# EAGLE design Uzebox Game Console nano4 (EAGLE 7.6.0)
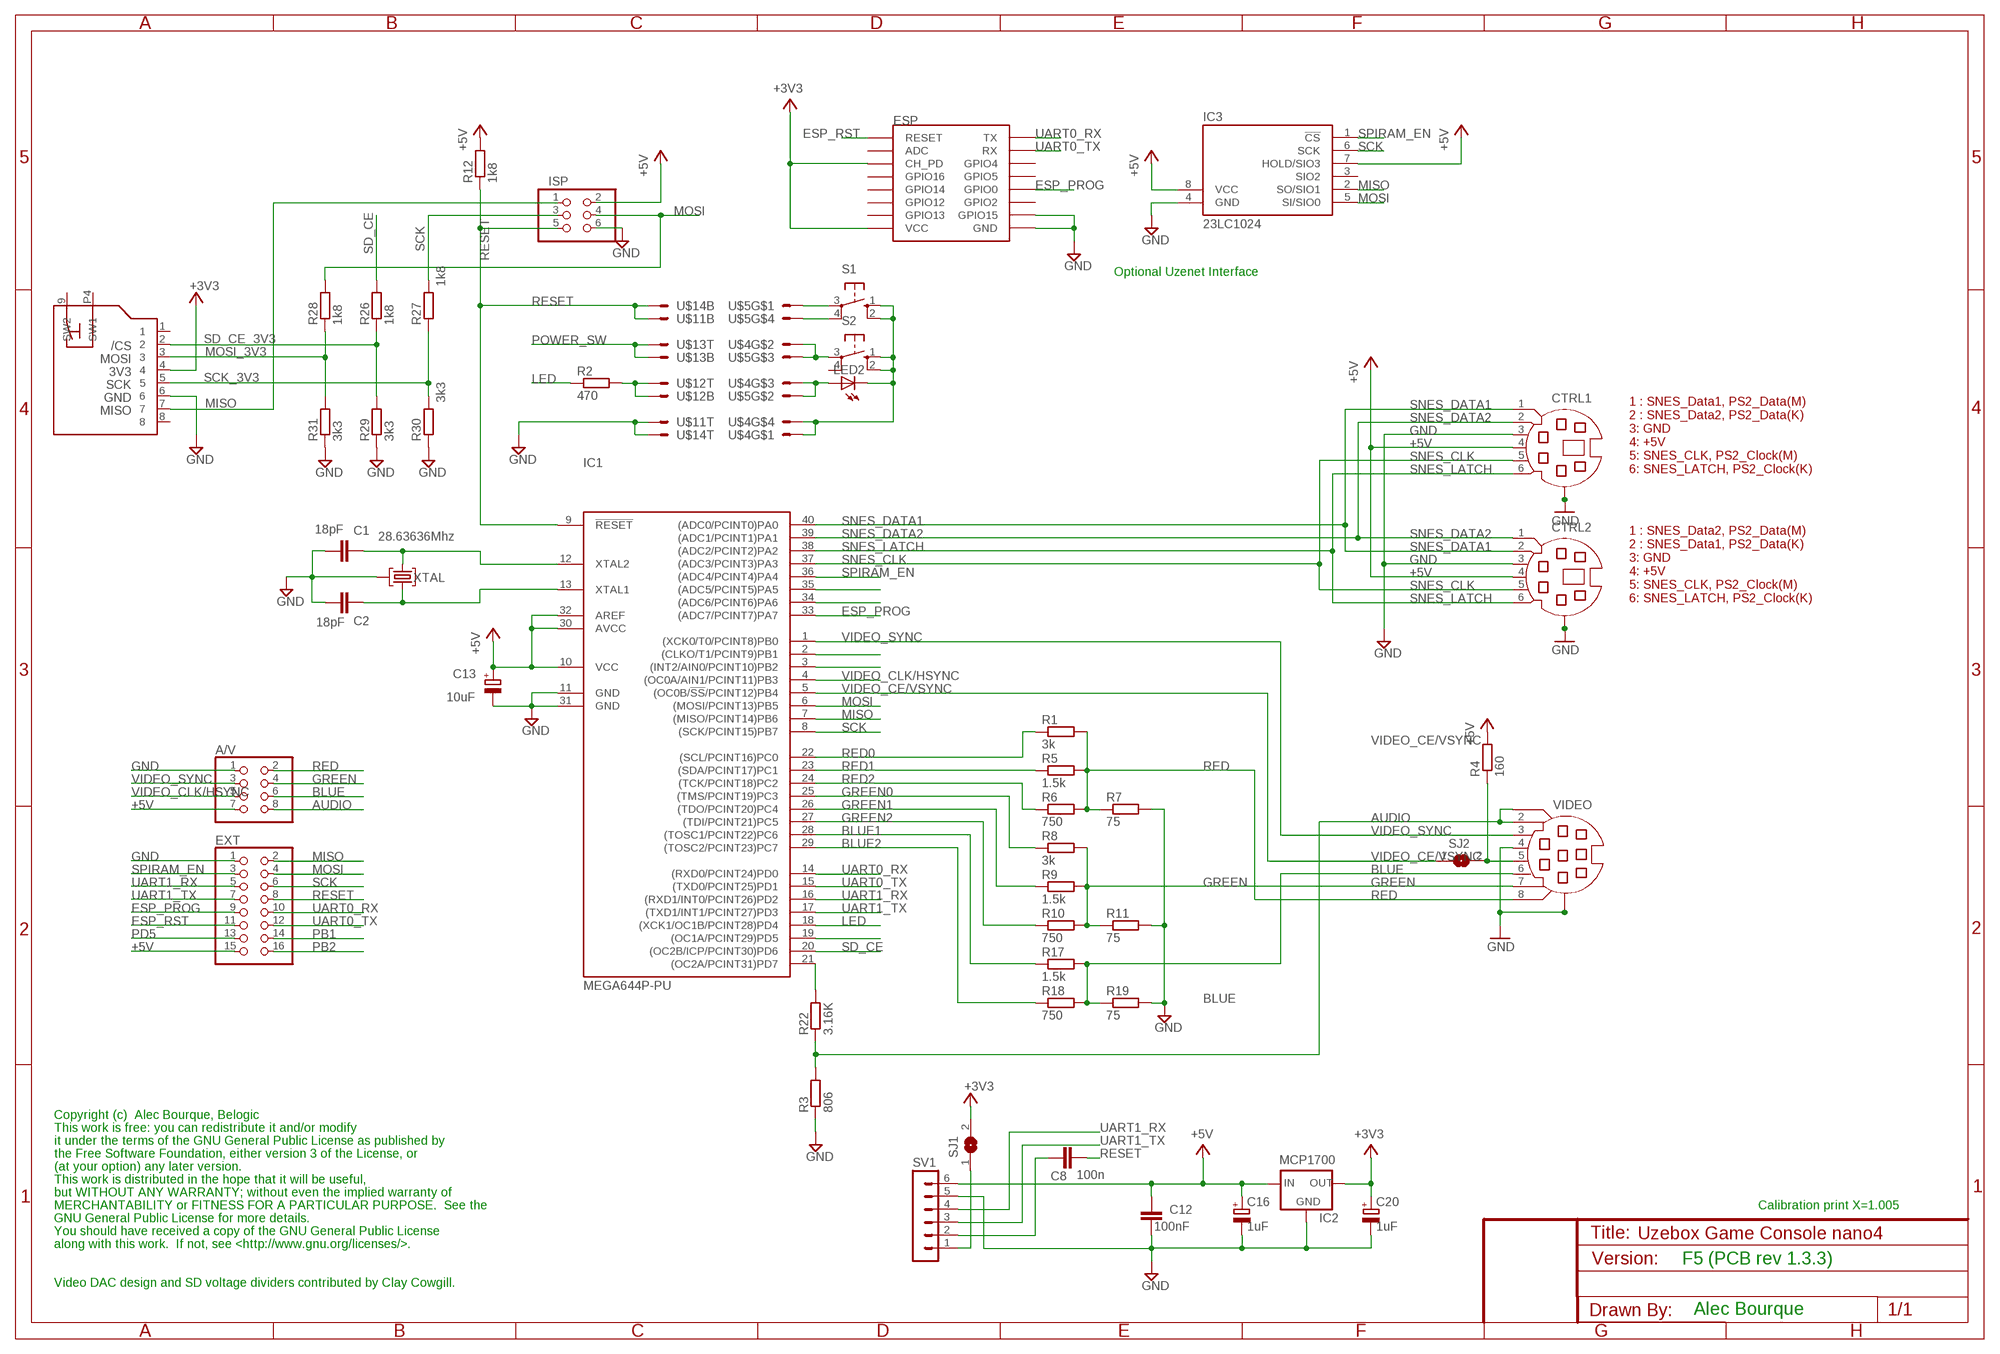
[diagram p0: schematic, sheet 1]

## Parts
A/V  PINHD-2X4  [2X04]
C1  18pF  C-EU025-025X050  [C025-025X050]
C2  18pF  C-EU025-025X050  [C025-025X050]
C8  100n  C-EU025-025X050  [C025-025X050]
C12  100nF  C-EU025-025X050  [C025-025X050]
C13  10uF  CPOL-EUE2.5-6  [E2,5-6]
C16  1uF  CPOL-EUE2.5-6  [E2,5-6]
C20  1uF  CPOL-EUE2.5-6  [E2,5-6]
CTRL1  MINI-DIN-6  [MINI-DIN-6]
CTRL2  MINI-DIN-6  [MINI-DIN-6]
ESP  ESP12SMD  [ESP12-SMD]
EXT  PINHD-2X8  [2X08]
IC1  MEGA644P-PU  MEGA164P/324P/644P-PU  [DIL40]
IC2  MCP1700  MCP1700INLINE  [TO92-INLINE]
IC3  23LC1024  [DIL08]
ISP  PINHD-2X3  [2X03]
J1  MICROSD-SWITCH  [MICROSD-ATOM]
LED2  LED3MM  [LED3MM]
R1  3k  R-EU_0207/10  [0207/10]
R2  470  R-EU_0207/10  [0207/10]
R3  806  R-EU_0207/10  [0207/10]
R4  160  R-EU_0207/10  [0207/10]
R5  1.5k  R-EU_0207/10  [0207/10]
R6  750  R-EU_0207/10  [0207/10]
R7  75  R-EU_0207/10  [0207/10]
R8  3k  R-EU_0207/10  [0207/10]
R9  1.5k  R-EU_0207/10  [0207/10]
R10  750  R-EU_0207/10  [0207/10]
R11  75  R-EU_0207/10  [0207/10]
R12  1k8  R-EU_0207/10  [0207/10]
R17  1.5k  R-EU_0207/10  [0207/10]
R18  750  R-EU_0207/10  [0207/10]
R19  75  R-EU_0207/10  [0207/10]
R22  3.16K  R-EU_0207/10  [0207/10]
R26  1k8  R-EU_0207/10  [0207/10]
R27  1k8  R-EU_0207/10  [0207/10]
R28  1k8  R-EU_0207/10  [0207/10]
R29  3k3  R-EU_0207/10  [0207/10]
R30  3k3  R-EU_0207/10  [0207/10]
R31  3k3  R-EU_0207/10  [0207/10]
S1  10-XX  [B3F-10XX]
S2  10-XX  [B3F-10XX]
SJ1  SJ  [SJ]
SJ2  SJ  [SJ]
SV1  MA06-1  [MA06-1]
U$1  PCB_CONNECTOR_4X2  [PCB_CONNECTOR_2X4POL]
U$4  PCB_CONNECTOR_1X4POL  [PCB_CONNECTOR_1X4POL]
U$5  PCB_CONNECTOR_1X4POL  [PCB_CONNECTOR_1X4POL]
VIDEO  MINI-DIN-8  [MINI-DIN-8]
XTAL  28.63636Mhz  HC49TL-H  [HC49TL-H]

## Nets
+3V3: C20.+ ESP.CH_PD ESP.VCC IC2.3(OUT) J1.4 SJ1.2
+5V: A/V.7 C12.1 C13.+ C16.+ CTRL1.4 CTRL2.4 EXT.15 IC1.10(VCC) IC1.30(AVCC) IC1.32(AREF) IC2.2(IN) IC3.7(HOLD/SIO3) IC3.8(VCC) ISP.2 R4.2 R12.2 SV1.6
AUDIO: A/V.8 R3.2 R22.1 VIDEO.1 VIDEO.2
BLUE: A/V.6 R17.2 R18.2 R19.1 VIDEO.6
BLUE1: IC1.28((TOSC1/PCINT22)PC6) R17.1
BLUE2: IC1.29((TOSC2/PCINT23)PC7) R18.1
ESP_PROG: ESP.GPIO0 EXT.9 IC1.33((ADC7/PCINT7)PA7)
ESP_RST: ESP.RESET EXT.11 IC1.34((ADC6/PCINT6)PA6)
GND: A/V.1 C1.2 C2.2 C12.2 C13.- C16.- C20.- CTRL1.3 CTRL1.G CTRL1.G1 CTRL1.G2 CTRL2.3 CTRL2.G CTRL2.G1 CTRL2.G2 ESP.GND ESP.GPIO15 EXT.1 IC1.11(GND) IC1.31(GND) IC2.1(GND) IC3.4(GND) ISP.6 J1.6 R3.1 R7.2 R11.2 R19.2 R29.1 R30.1 R31.1 SV1.5 U$1.1T U$1.4T VIDEO.4 VIDEO.G1(G2) VIDEO.G2(G3) VIDEO.G(G1) XTAL.3
GREEN: A/V.4 R8.2 R9.2 R10.2 R11.1 VIDEO.7
GREEN0: IC1.25((TMS/PCINT19)PC3) R8.1
GREEN1: IC1.26((TDO/PCINT20)PC4) R9.1
GREEN2: IC1.27((TDI/PCINT21)PC5) R10.1
LED: IC1.18((XCK1/OC1B/PCINT28)PD4) R2.1
MISO: EXT.2 IC1.7((MISO/PCINT14)PB6) IC3.2(SO/SIO1) ISP.1 J1.7
MOSI: EXT.4 IC1.6((MOSI/PCINT13)PB5) IC3.5(SI/SIO0) ISP.4 R28.2
MOSI_3V3: J1.3 R28.1 R31.2
N$1: R4.1 SJ2.2 VIDEO.5
N$6: C8.2 SV1.2
N$9: C1.1 IC1.12(XTAL2) XTAL.2
N$12: C2.1 IC1.13(XTAL1) XTAL.1
N$13: IC1.21((OC2A/PCINT31)PD7) R22.2
N$14: R2.2 U$1.2B U$1.2T
N$16: LED2.K(C) S1.1(S) S1.2(S1) S2.1(S) S2.2(S1) U$4.1T U$4.4T
N$17: SJ1.1 SV1.1
N$18: S1.3(P) U$5.1T
N$19: S2.3(P) U$4.2T U$5.3T
N$20: S1.4(P1) U$5.4T
N$21: LED2.A U$4.3T U$5.2T
PB1: EXT.14 IC1.2((CLKO/T1/PCINT9)PB1)
PB2: EXT.16 IC1.3((INT2/AIN0/PCINT10)PB2)
PD5: EXT.13 IC1.19((OC1A/PCINT29)PD5)
POWER_SW: IC1.35((ADC5/PCINT5)PA5) U$1.3B U$1.3T
RED: A/V.2 R1.2 R5.2 R6.2 R7.1 VIDEO.8
RED0: IC1.22((SCL/PCINT16)PC0) R1.1
RED1: IC1.23((SDA/PCINT17)PC1) R5.1
RED2: IC1.24((TCK/PCINT18)PC2) R6.1
RESET: C8.1 EXT.8 IC1.9(!RESET) ISP.5 R12.1 U$1.1B U$1.4B
SCK: EXT.6 IC1.8((SCK/PCINT15)PB7) IC3.6(SCK) ISP.3 R27.2
SCK_3V3: J1.5 R27.1 R30.2
SD_CE: IC1.20((OC2B/ICP/PCINT30)PD6) R26.2
SD_CE_3V3: J1.2 R26.1 R29.2
SNES_CLK: CTRL1.5 CTRL2.5 IC1.37((ADC3/PCINT3)PA3)
SNES_DATA1: CTRL1.1 CTRL2.2 IC1.40((ADC0/PCINT0)PA0)
SNES_DATA2: CTRL1.2 CTRL2.1 IC1.39((ADC1/PCINT1)PA1)
SNES_LATCH: CTRL1.6 CTRL2.6 IC1.38((ADC2/PCINT2)PA2)
SPIRAM_EN: EXT.3 IC1.36((ADC4/PCINT4)PA4) IC3.1(!CS)
UART0_RX: ESP.TXD0(TX) EXT.10 IC1.14((RXD0/PCINT24)PD0)
UART0_TX: ESP.RXD0(RX) EXT.12 IC1.15((TXD0/PCINT25)PD1)
UART1_RX: EXT.5 IC1.16((RXD1/INT0/PCINT26)PD2) SV1.4
UART1_TX: EXT.7 IC1.17((TXD1/INT1/PCINT27)PD3) SV1.3
VIDEO_CE/VSYNC: IC1.5((OC0B/!SS!/PCINT12)PB4) SJ2.1
VIDEO_CLK/HSYNC: A/V.5 IC1.4((OC0A/AIN1/PCINT11)PB3)
VIDEO_SYNC: A/V.3 IC1.1((XCK0/T0/PCINT8)PB0) VIDEO.3
Unconnected: ESP.ADC ESP.GPIO2 ESP.GPIO4 ESP.GPIO5 ESP.GPIO12 ESP.GPIO13 ESP.GPIO14 ESP.GPIO16 IC3.3(SIO2) J1.1 J1.8 J1.9(SW2) J1.P1 J1.P2(P1) J1.P3(P1) J1.P4(SW1) S2.4(P1)

## Notes on the sheet
- Optional Uzenet Interface
- 1 : SNES_Data1, PS2_Data(M)
  2 : SNES_Data2, PS2_Data(K)
  3: GND
  4: +5V
  5: SNES_CLK, PS2_Clock(M)
  6: SNES_LATCH, PS2_Clock(K)
- 1 : SNES_Data2, PS2_Data(M)
  2 : SNES_Data1, PS2_Data(K)
  3: GND
  4: +5V
  5: SNES_CLK, PS2_Clock(M)
  6: SNES_LATCH, PS2_Clock(K)
- Copyright (c)  Alec Bourque, Belogic
- This work is free: you can redistribute it and/or modify
- it under the terms of the GNU General Public License as published by
- the Free Software Foundation, either version 3 of the License, or
- (at your option) any later version.
- This work is distributed in the hope that it will be useful,
- but WITHOUT ANY WARRANTY; without even the implied warranty of
- MERCHANTABILITY or FITNESS FOR A PARTICULAR PURPOSE.  See the | Calibration print X=1.005
- GNU General Public License for more details.
- You should have received a copy of the GNU General Public License
- along with this work.  If not, see <http://www.gnu.org/licenses/>.
- F5 (PCB rev 1.3.3)
- Video DAC design and SD voltage dividers contributed by Clay Cowgill.
- Alec Bourque

## Library data of the parts
A/V = pinhead:PINHD-2X4: PIN HEADER
C1 C2 C8 C12 = rcl:C-EU: CAPACITOR, European symbol
C13 C16 C20 = rcl:CPOL-EU: POLARIZED CAPACITOR, European symbol
CTRL1 CTRL2 = Thorsten_connectors:MINI-DIN-6: YAMAICHI CONNECTOR; OC_FARNELL: unknown; OC_NEWARK: unknown
ESP = esp8266:ESP12: ESP8266 Wifi module 12
EXT = pinhead:PINHD-2X8: PIN HEADER
IC1 = avr-5:MEGA164P/324P/644P-PU
IC2 = adafruit:MCP1700: VOLTAGE REGULATOR; DPN: MCP1700-3302E/TO-ND
IC3 = uzebox:23LC1024: 1Mbit SPI Serial SRAM with SDI and SQI Interface
ISP = pinhead:PINHD-2X3: PIN HEADER; PN: 609-2436-ND
J1 = Thorsten_diverses:MICROSD-SWITCH
LED2 = adafruit:LED: LED OSRAM: - CHIPLED LG R971, LG N971, LY N971, LG Q971, LY Q971, LO R971, LY R971 LH N974, LH R974 LS Q976, LO Q976, LY Q976 LO Q996 - Hyper CHIPLED LW Q18S LB Q993, LB Q99A, LB R99A - SideLED LS A670, LO A670, LY A670, LG A670, LP A670 LB A673, LV A673, LT A673, LW A673 LH A674 LY A675 LS A676, LA A676, LO A676, LY A676, LW A676 LS A679, LY A679, LG A679 - Hyper Micro SIDELED® LS Y876, LA Y876, LO Y876, LY Y876 LT Y87S - SmartLED LW L88C, LW L88S LB L89C, LB L89S, LG L890 LS L89K, LO L89K, LY L89K LS L896, LA L896, LO L896, LY L896 - TOPLED LS T670, LO T670, LY T670, LG T670, LP T670 LSG T670, LSP T670, LSY T670, LOP T670, LYG T670 LG T671, LOG T671, LSG T671 LB T673, LV T673, LT T673, LW T673 LH T674 LS T676, LA T676, LO T676, LY T676, LB T676, LH T676, LSB T676, LW T676 LB T67C, LV T67C, LT T67C, LS T67K, LO T67K, LY T67K, LW E67C LS E67B, LA E67B, LO E67B, LY E67B, LB E67C, LV E67C, LT E67C LW T67C LS T679, LY T679, LG T679 LS T770, LO T770, LY T770, LG T770, LP T770 LB T773, LV T773, LT T773, LW T773 LH T774 LS E675, LA E675, LY E675, LS T675 LS T776, LA T776, LO T776, LY T776, LB T776 LHGB T686 LT T68C, LB T68C - Hyper Mini TOPLED® LB M676 - Mini TOPLED Santana® LG M470 LS M47K, LO M47K, LY M47K Source: http://www.osram.convergy.de/
R1-R12 R17-R19 R22 R26-R31 = rcl:R-EU_: RESISTOR, European symbol
S1 S2 = switch-omron:10-XX: OMRON SWITCH; MPN: B3F-1000; OC_FARNELL: 176432; OC_NEWARK: 36M3542
SJ1 SJ2 = jumper:SJ: SMD solder JUMPER
SV1 = con-lstb:MA06-1: PIN HEADER; OC_FARNELL: unknown; OC_NEWARK: unknown
U$1 = Thorsten_connectors:PCB_CONNECTOR_4X2
U$4 U$5 = Thorsten_connectors:PCB_CONNECTOR_1X4POL
VIDEO = Thorsten_connectors:MINI-DIN-8
XTAL = crystal:HC49TL-H: CRYSTAL; OC_FARNELL: unknown; OC_NEWARK: unknown; PN: 887-1256-ND

## Board
V1.3.0: Added Uzenet interface. ESP-12 and SPI RAM. V1.3.1: Fix for ESP-12. Added missing routing between GND and GPIO15. V1.3.2: Fix for SPI RAM instability. Connected pin7 (/HOLD) to VCC.
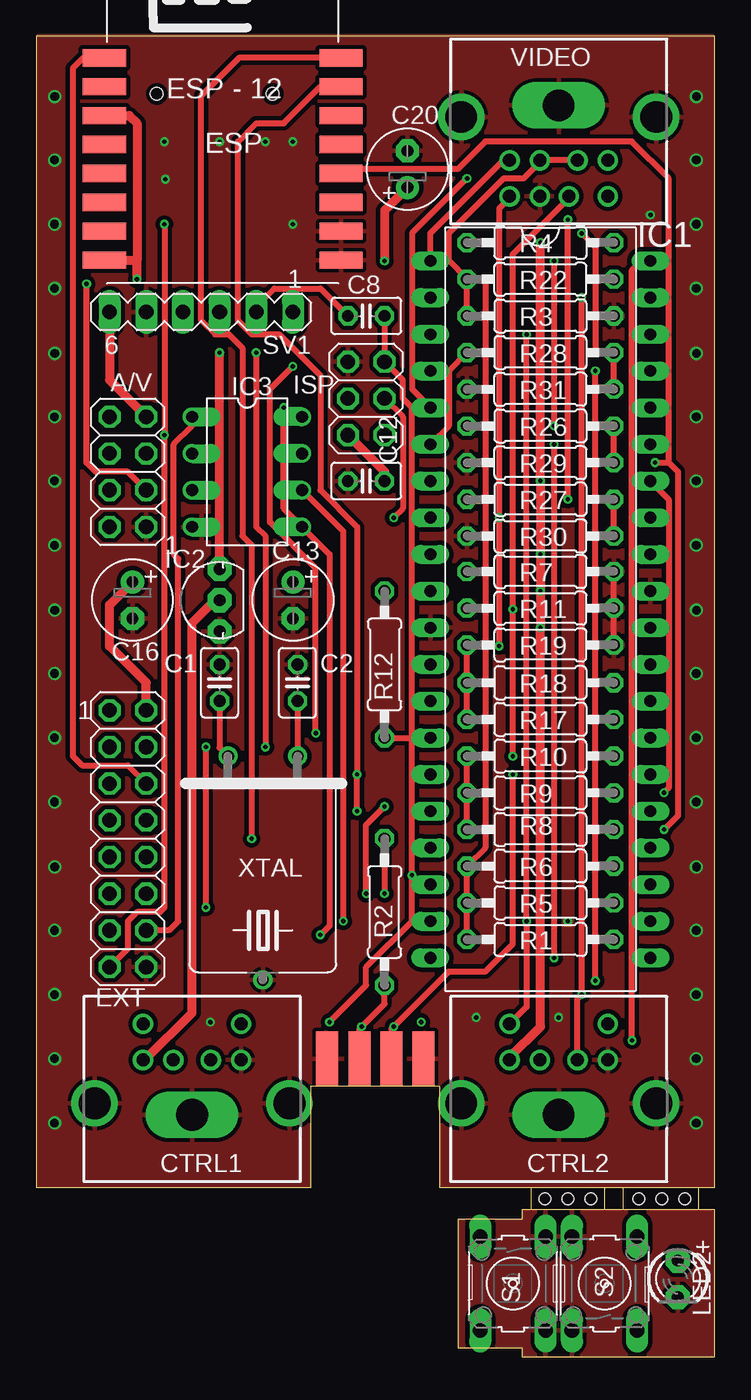
[diagram p1: board, top side]
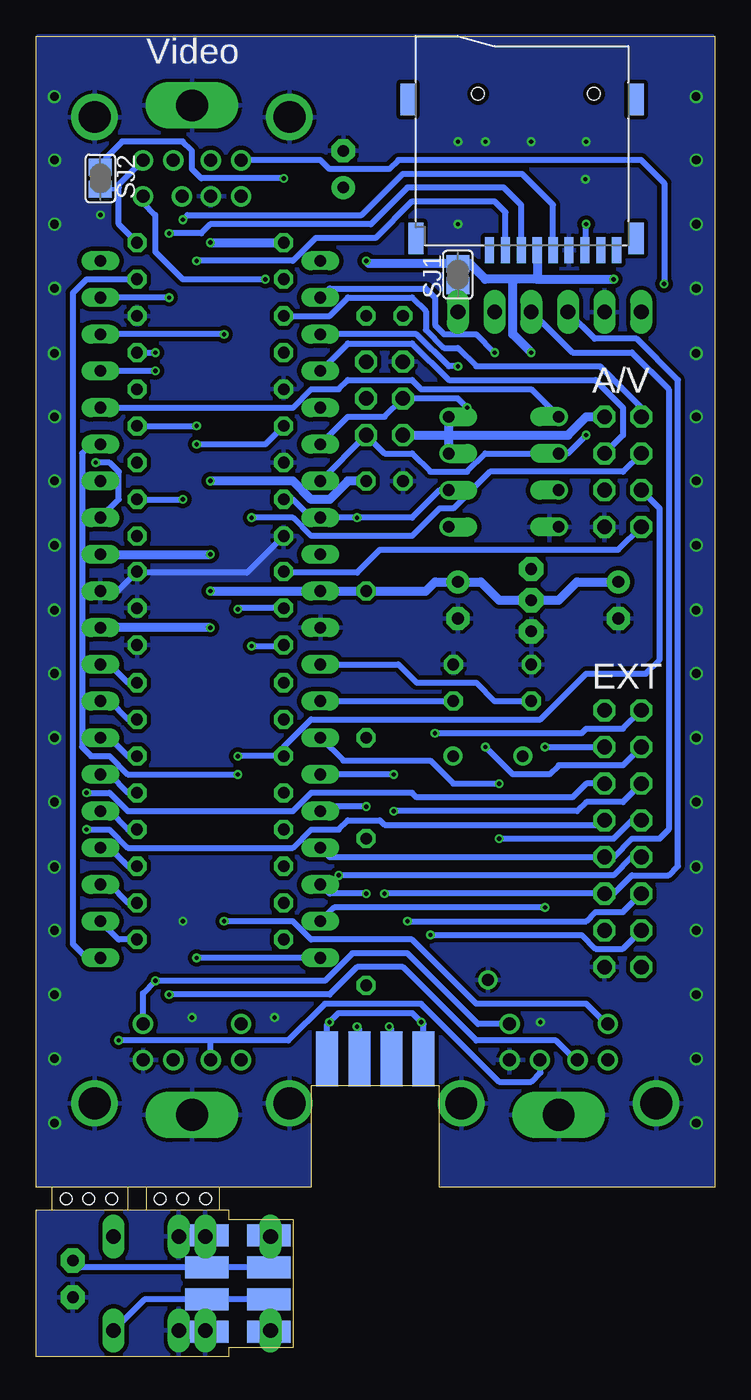
[diagram p2: board, bottom side, seen from below]

Size 47 x 91.45 mm. Coordinates in mm from the lower left corner, seen from the top.
Outline: 34.3,11.75 27.95,11.75 27.95,18.75 19.05,18.75 19.05,11.75 0,11.75 0,91.45 47,91.45 47,11.75 45.88,11.75
Outline: 34.3,11.75 39.38,11.75
Outline: 39.38,11.75 40.64,11.75
Outline: 40.64,11.75 45.88,11.75
Outline: 45.88,10.16 47,10.16 47,0 33.66,0 33.66,0.63 29.21,0.63 29.21,9.52 33.66,9.52 33.66,10.16 34.3,10.16
Outline: 45.88,10.16 40.64,10.16
Outline: 40.64,10.16 39.38,10.16
Outline: 39.38,10.16 34.3,10.16
Outline: 34.3,10.16 34.3,11.75
Outline: 45.88,10.16 45.88,11.75
Outline: 40.64,11.75 40.64,10.16
Outline: 39.38,11.75 39.38,10.16
Copper layers (1*16): Top 0.035mm / dielectric 1.5mm / Bottom 0.035mm
Design rules "ITEADstudio_DRC *": minimum track width 6mil, minimum drill 0.2mm, track to track 5mil, track to pad 6mil, pad to pad 6mil, via to via 6mil, smd to smd 0mil, copper to edge 0mil, drill to drill 10mil, minimum pad ring 10mil, minimum via ring 6mil, stop-mask expansion 2mil, vias tented up to drill 100mil, thermal gap 10mil
Holes 0.8 mm at 41.76,10.95 43.34,10.95 44.93,10.95 35.25,10.95 36.84,10.95 38.42,10.95

### Footprints (pad centres in the part's own frame; a part is rotated, then mirrored left to right if it is on the bottom)
2X04 = drill 1.016 octagon: 1 -3.81,-1.27; 2 -3.81,1.27; 3 -1.27,-1.27; 4 -1.27,1.27; 5 1.27,-1.27; 6 1.27,1.27; 7 3.81,-1.27; 8 3.81,1.27
C025-025X050 = drill 0.813 octagon: 1 -1.27,0; 2 1.27,0
E2,5-6 = drill 0.813 pad 1.6: + -1.27,0 | drill 0.813 pad 1.6 octagon: - 1.27,0
MINI-DIN-6 = drill 0.9: 1 1.3,8.4; 2 -1.3,8.4; 3 3.4,8.4; 4 -3.4,8.4; 5 3.4,10.9; 6 -3.4,10.9 | drill 2.2 long: G 0,4.6 | drill 2.2: G1 -6.75,5.4; G2 6.75,5.4
ESP12-SMD = smd 3 x 1.2: ADC -8.3,3.8; CH_PD -8.3,1.8; GND 8.1,-8.2; GPIO0 8.1,-2.2; GPIO2 8.1,-4.2; GPIO4 8.1,1.8; GPIO5 8.1,-0.2; GPIO12 -8.3,-4.2; GPIO13 -8.3,-6.2; GPIO14 -8.3,-2.2; GPIO15 8.1,-6.2; GPIO16 -8.3,-0.2; RESET -8.3,5.8; RXD0 8.1,3.8; TXD0 8.1,5.8; VCC -8.3,-8.2
2X08 = drill 1.016 octagon: 1 -8.89,-1.27; 2 -8.89,1.27; 3 -6.35,-1.27; 4 -6.35,1.27; 5 -3.81,-1.27; 6 -3.81,1.27; 7 -1.27,-1.27; 8 -1.27,1.27; 9 1.27,-1.27; 10 1.27,1.27; 11 3.81,-1.27; 12 3.81,1.27; 13 6.35,-1.27; 14 6.35,1.27; 15 8.89,-1.27; 16 8.89,1.27
DIL40 = drill 0.813 long: 1 -24.13,-7.62; 2 -21.59,-7.62; 3 -19.05,-7.62; 4 -16.51,-7.62; 5 -13.97,-7.62; 6 -11.43,-7.62; 7 -8.89,-7.62; 8 -6.35,-7.62; 9 -3.81,-7.62; 10 -1.27,-7.62; 11 1.27,-7.62; 12 3.81,-7.62; 13 6.35,-7.62; 14 8.89,-7.62; 15 11.43,-7.62; 16 13.97,-7.62; 17 16.51,-7.62; 18 19.05,-7.62; 19 21.59,-7.62; 20 24.13,-7.62; 21 24.13,7.62; 22 21.59,7.62; 23 19.05,7.62; 24 16.51,7.62; 25 13.97,7.62; 26 11.43,7.62; 27 8.89,7.62; 28 6.35,7.62; 29 3.81,7.62; 30 1.27,7.62; 31 -1.27,7.62; 32 -3.81,7.62; 33 -6.35,7.62; 34 -8.89,7.62; 35 -11.43,7.62; 36 -13.97,7.62; 37 -16.51,7.62; 38 -19.05,7.62; 39 -21.59,7.62; 40 -24.13,7.62
TO92-INLINE = drill 0.813 pad 1.676 octagon: 1 -2.159,0; 2 0,0; 3 2.159,0
DIL08 = drill 0.813 offset: 1 -5.08,-5.08; 2 -2.54,-5.08; 3 0,-5.08; 4 2.54,-5.08; 5 2.54,2.54; 6 0,2.54; 7 -2.54,2.54; 8 -5.08,2.54
2X03 = drill 1.016 octagon: 1 -2.54,-1.27; 2 -2.54,1.27; 3 0,-1.27; 4 0,1.27; 5 2.54,-1.27; 6 2.54,1.27
MICROSD-ATOM = smd 0.635 x 1.778: 1 2.25,0.318; 2 1.15,0.318; 3 0.05,0.318; 4 -1.05,0.318; 5 -2.15,0.318; 6 -3.25,0.318; 7 -4.35,0.318; 8 -5.45,0.318; 9 -6.55,0.318 | smd 1.067 x 2.184: P1 -7.9,-0.5; P2 7.35,-0.5; P3 -7.9,-10.1; P4 7.9,-10.1 | hole 0.88: -4.98,-10.5; 3.05,-10.5
LED3MM = drill 0.813 pad 1.676 octagon: A -1.27,0; K 1.27,0
0207/10 = drill 0.813 octagon: 1 -5.08,0; 2 5.08,0
B3F-10XX = drill 1.016 long: 1 -3.251,2.261; 2 3.251,2.261; 3 -3.251,-2.261; 4 3.251,-2.261
SJ = smd 1.168 x 1.6: 1 -0.762,0; 2 0.762,0
MA06-1 = drill 1.016 long: 1 -6.35,0; 2 -3.81,0; 3 -1.27,0; 4 1.27,0; 5 3.81,0; 6 6.35,0
PCB_CONNECTOR_2X4POL = smd 1.524 x 3.81 bottom: 1B -3.334,1.905; 2B -1.111,1.905; 3B 1.111,1.905; 4B 3.334,1.905 | smd 1.524 x 3.81: 1T -3.334,1.905; 2T -1.111,1.905; 3T 1.111,1.905; 4T 3.334,1.905
PCB_CONNECTOR_1X4POL = smd 1.524 x 3: 1T -3.334,2.14; 2T -1.111,2.14; 3T 1.111,2.14; 4T 3.334,2.14
MINI-DIN-8 = drill 0.9: 1 1.3,8.4; 2 -1.3,8.4; 3 3.4,8.4; 4 1.3,10.9; 5 -3.4,8.4; 6 3.4,10.9; 7 -0.7,10.9; 8 -3.4,10.9 | drill 2.2 long: G 0,4.6 | drill 2.2: G1 -6.75,5.4; G2 6.75,5.4
HC49TL-H = drill 0.813: 1 -2.413,-7.62; 2 2.413,-7.62; 3 0,7.874

### Placement (x,y rotation side)
A/V  6.36,61.28 90 top
C1  12.71,46.67 90 top
C2  18.1,46.67 90 top
C8  22.86,72.07 180 top
C12  22.86,60.64 180 top
C13  17.79,52.39 270 top
C16  6.67,52.39 270 top
C20  25.72,82.23 90 top
CTRL1  10.8,12.15 0 top
CTRL2  36.2,12.15 0 top
ESP  13.02,84.14 0 top
EXT  6.36,35.88 90 top
IC1  34.93,51.75 270 top
IC2  12.71,52.39 90 top
IC3  15.88,60.01 270 top
ISP  22.86,66.36 90 top
J1  13.34,76.95 180 bottom
LED2  44.45,5.4 270 top
R1  34.93,28.89 180 top
R2  24.14,30.8 270 top
R3  34.93,72.07 180 top
R4  34.93,77.15 180 top
R5  34.93,31.43 180 top
R6  34.93,33.97 180 top
R7  34.93,54.37 0 top
R8  34.93,36.51 180 top
R9  34.93,39.05 180 top
R10  34.93,41.59 180 top
R11  34.93,51.83 0 top
R12  24.14,47.94 90 top
R17  34.93,44.13 180 top
R18  34.93,46.67 180 top
R19  34.93,49.29 0 top
R22  34.93,74.61 0 top
R26  34.93,64.45 180 top
R27  34.93,59.37 180 top
R28  34.93,69.53 180 top
R29  34.93,61.91 0 top
R30  34.93,56.83 0 top
R31  34.93,66.99 0 top
S1  33.02,5.08 270 top
S2  39.38,5.08 90 top
SJ1  17.79,74.93 90 bottom
SJ2  42.55,81.6 270 bottom
SV1  11.44,72.35 180 top
U$1  23.5,18.73 0 top
U$4  33.02,5.08 90 bottom
U$5  33.02,5.08 270 bottom
U$6  [LOGO]  19.16,105.53 0 top  (outside the outline)
VIDEO  36.2,91.25 180 top
XTAL  15.71,33.97 180 top

### Tracks (layer width: path | path; a pad name or v marks a point on that pad's centre or on a via)
+3V3  (via drill 0.3)
  Top 0.406: ESP.VCC 5.04,75.94 5.09,75.88
  Top 0.61: IC2.3 12.64,54.55 12.71,55.25 v12.71,69.53 | v6.99,74.61 6.99,75.88 | 6.99,75.88 5.09,75.88 | ESP.CH_PD 6.46,85.94 6.99,85.41 6.99,75.88 | C20.+ 24.14,79.37 v24.14,75.88
  Bottom 0.61: v12.71,69.53 13.97,70.8 13.97,74.61 | 13.97,74.61 15.88,74.61 16.96,75.69 SJ1.2 23.95,75.69 v24.14,75.88 | 12.29,74.61 13.97,74.61 | 12.29,74.61 v6.99,74.61 | J1.4 12.29,74.61
+5V  (via drill 0.3)
  Top 0.61: CTRL2.4 32.8,20.73 34.93,22.86 v34.93,50.48 v34.93,53.02 v34.93,55.56 v34.93,60.64 v34.93,77.15 | SV1.6 5.09,67.63 A/V.7 | ISP.2 24.14,61.28 C12.1 | IC2.2 12.39,52.39 10.8,50.8 10.8,23.81 7.54,20.55 CTRL1.4 | EXT.15 7.62,46.67 5.09,49.21 5.09,52.07 C16.+
  Bottom 0.61: v34.93,50.48 IC1.30 | IC1.32 v34.93,55.56 | v34.93,53.02 IC1.10 R12.2 20.01,53.02 19.37,53.66 C13.+ 16.2,53.66 14.93,52.39 IC2.2 10.8,52.39 9.53,53.66 C16.+ | IC3.7 18.42,63.82 | 18.42,63.82 IC3.8 | ISP.2 18.42,63.82 | 18.42,63.82 10.16,63.82 8.89,65.09 A/V.7 | C12.1 25.41,60.64 26.68,59.37 27.95,59.37 29.21,60.64 v34.93,60.64 | v34.93,77.15 R4.2
AUDIO
  Top 0.406: R3.2 R22.1 28.58,75.88 28.58,77.79 32.39,81.6 33.77,81.6 34.9,82.72 VIDEO.1 VIDEO.2
  Bottom 0.406: R3.2 26.68,72.07 25.41,73.34 20.96,73.34 20.01,72.39 20.01,71.12 18.74,69.85 17.79,69.85 16.52,68.58 7.94,68.58 5.09,65.72 A/V.8
BLUE  (via drill 0.3)
  Top 0.406: v32.07,49.21 v32.07,58.1 32.07,79.5 32.8,80.22 VIDEO.6 | R17.2 R18.2 R19.1
  Bottom 0.406: A/V.6 6.36,61.28 15.56,61.28 18.1,58.74 19.05,58.74 20.96,56.83 27.95,56.83 29.21,58.1 v32.07,58.1 | v32.07,49.21 29.93,49.21 R19.1
BLUE1
  Bottom 0.406: R17.1 40.64,44.13 41.91,45.4 IC1.28
BLUE2
  Bottom 0.406: R18.1 40.64,46.67 41.91,47.94 IC1.29
ESP_PROG  (via drill 0.3)
  Top 0.406: v43.5,36.51 44.45,37.47 44.45,61.28 43.82,61.91 | v42.87,61.91 43.82,61.91 | 43.82,61.91 43.82,81.6 41.28,84.14 31.12,84.14 29.21,82.23 22.23,82.23 21.93,81.94 ESP.GPIO0
  Bottom 0.406: v43.5,36.51 41.91,36.51 40.64,35.24 29.21,35.24 27.95,36.51 26.04,36.51 25.41,37.15 23.18,37.15 22.86,36.83 7.94,36.83 EXT.9 | IC1.33 41.28,59.37 41.28,61.28 41.91,61.91 v42.87,61.91
ESP_RST  (via drill 0.3)
  Top 0.406: ESP.RESET 3.27,89.94 2.55,89.22 2.55,41.59 3.18,40.96 6.36,40.96 EXT.11 | IC1.34 43.82,59.37 43.82,39.37 v43.5,39.05
  Bottom 0.406: v43.5,39.05 41.91,39.05 40.64,37.78 29.21,37.78 27.95,39.05 20.96,39.05 20.64,38.74 9.85,38.74 8.89,39.69 EXT.11
GND  (via drill 0.3, 0.6)
  Top 0.406: R19.2 R11.2 R7.2
  Bottom 0.406: R30.1 32.39,54.29 39.93,54.29 R7.2 41.36,53.02 IC1.31
  other vias: 12.71,84.14 8.96,81.54 8.89,84.14 1.29,87.26 1.27,82.87 36.84,30.16 1.27,73.98 12.07,23.18 36.2,23.5 30.48,23.5 1.27,78.42 15.88,84.14 17.79,84.14 17.79,78.42 42.55,79.06 1.29,69.48 1.27,65.09 1.27,56.2 1.27,60.64 1.29,51.7 1.27,47.31 1.27,38.42 1.27,42.86 1.29,33.92 1.27,29.53 1.27,20.64 1.27,25.08 1.27,16.19 45.73,33.92 45.73,29.53 45.73,20.64 45.73,25.08 45.73,16.19 45.73,51.7 45.73,47.31 45.73,38.42 45.73,42.86 45.73,69.48 45.73,65.09 45.73,56.2 45.73,60.64 45.73,87.26 45.73,82.87 45.73,73.98 45.73,78.42
  pour Bottom (isolate 0.3): 0.16,91.45 46.84,91.45 46.84,11.91 28.1,11.91 28.1,18.89 18.9,18.89 18.9,11.91 0.16,11.91
  pour Top (isolate 0.3): 0.16,91.45 46.84,91.45 46.84,11.91 28.1,11.91 28.1,18.89 18.9,18.89 18.9,11.91 0.16,11.91
GREEN  (via drill 0.3)
  Top 0.406: v33.02,41.59 v33.02,51.75 33.02,76.35 36.9,80.22 VIDEO.7 | R8.2 R9.2 R10.2
  Bottom 0.406: v33.02,41.59 R10.2 29.85,42.23 27.95,44.13 12.07,44.13 8.89,47.31 4.77,47.31 3.82,48.26 3.82,58.74 A/V.4 | R11.1 32.95,51.83 v33.02,51.75
GREEN0
  Bottom 0.406: R8.1 40.64,36.51 41.91,37.78 IC1.25
GREEN1
  Bottom 0.406: R9.1 40.64,39.05 41.91,40.32 IC1.26
GREEN2
  Bottom 0.406: R10.1 40.64,41.59 41.91,42.86 IC1.27
LED  (via drill 0.3)
  Top 0.406: R2.1 v24.14,32.07
  Bottom 0.406: v24.14,32.07 26.68,32.07 IC1.18
MISO  (via drill 0.3)
  Top 0.406: v8.89,78.42 v8.89,63.82 8.89,31.11 8.58,30.8 6.99,30.8 6.36,30.16 6.36,28.26 EXT.2
  Bottom 0.406: IC1.7 ISP.1 22.86,62.55 20.96,62.55 19.69,61.28 17.15,61.28 15.88,62.55 IC3.2 10.16,62.55 v8.89,63.82 | J1.7 8.99,77.06 8.92,77.13 8.92,78.4 v8.89,78.42
MOSI  (via drill 0.3)
  Top 0.406: R28.2 28.58,68.26 28.58,64.45 IC1.6 | v17.15,65.72 17.15,58.74 IC3.5 20.32,55.56 20.32,29.85 v19.69,29.21
  Bottom 0.406: IC1.6 25.41,65.09 22.86,65.09 ISP.4 17.79,66.36 v17.15,65.72 | v19.69,29.21 9.21,29.21 8.26,28.26 6.36,28.26 EXT.4
MOSI_3V3  (via drill 0.3)
  Top 0.406: R31.2 R28.1 | v37.79,77.79 38.74,76.84 v38.74,69.53
  Bottom 0.406: R28.1 v38.74,69.53 | J1.3 13.39,79.74 14.61,80.96 21.28,80.96 23.82,78.42 34.93,78.42 35.56,77.79 v37.79,77.79
N$1
  Bottom 0.305: SJ2.2 41.41,80.84 41.28,80.96
  Bottom 0.406: R4.1 41.28,78.42 41.28,80.96 41.28,81.17 VIDEO.5
N$6
  Top 0.406: SV1.2 15.24,72.71 16.52,73.98 19.69,73.98 C8.2
N$9
  Top 0.406: C1.1 12.71,42.18 XTAL.2
  Bottom 0.406: IC1.12 21.91,47.94 20.64,46.67 16.52,46.67 15.24,45.4 C1.1
N$12
  Top 0.406: C2.1 18.1,41.61 XTAL.1
  Bottom 0.406: IC1.13 C2.1
N$13
  Bottom 0.406: IC1.21 43.5,27.62 44.45,28.58 44.45,73.66 43.5,74.61 R22.2
N$14  (via drill 0.3)
  Top 0.406: U$1.2B 22.39,22.7 v22.55,22.86 24.14,24.45 R2.2
  Bottom 0.406: U$1.2B 22.39,22.7 v22.55,22.86
N$16
  pour Top (isolate 0.3): 46.84,0.16 33.82,0.16 33.82,0.79 29.37,0.79 29.37,9.37 33.82,9.37 33.82,10 46.84,10
  pour Bottom (isolate 0.3): 46.84,0.16 33.82,0.16 33.82,10 46.84,10
N$17
  Bottom 0.61: SJ1.1 SV1.1
N$18
  Bottom 0.406: S1.3 30.8,8.33 U$5.1T
N$19
  Bottom 0.406: U$5.3T U$4.2T 39.5,3.97 S2.3
N$20
  Bottom 0.406: U$5.4T 30.85,1.75 S1.4
N$21
  Bottom 0.406: LED2.A 43.98,6.19 U$4.3T U$5.2T
PB1  (via drill 0.3)
  Top 0.406: v15.24,69.53 15.24,57.47 15.88,56.83 v15.88,42.23
  Bottom 0.406: IC1.2 26.68,73.98 20.01,73.98 19.37,73.34 19.37,71.44 18.74,70.8 16.52,70.8 v15.24,69.53 | EXT.14 6.36,40.96 10.8,40.96 11.44,40.32 13.97,40.32 v15.88,42.23
PB2  (via drill 0.3)
  Top 0.406: v19.37,43.18 19.37,54.61 16.2,57.79 16.2,66.99 v17.79,68.58
  Bottom 0.406: v17.79,68.58 18.42,68.58 20.64,70.8 IC1.3 | v19.37,43.18 9.21,43.18 8.89,43.5 6.36,43.5 EXT.16
PD5  (via drill 0.3)
  Top 0.406: v11.75,42.23 v11.75,31.11
  Bottom 0.406: v11.75,31.11 26.36,31.11 IC1.19 | v11.75,42.23 EXT.13
POWER_SW  (via drill 0.3)
  Top 0.406: v33.02,40.32 33.02,28.58 31.12,26.67 28.58,26.67 v24.77,22.86 24.61,22.7 U$1.3B
  Bottom 0.406: U$1.3B 24.61,22.7 v24.77,22.86 | v33.02,40.32 40.64,40.32 41.91,41.59 43.19,41.59 43.82,42.23 43.82,62.55 43.19,63.18 IC1.35
RED  (via drill 0.3)
  Top 0.406: R1.2 R5.2 R6.2 31.12,35.24 31.12,54.29 | v31.12,74.61 31.12,54.29 | R7.1 31.04,54.37 31.12,54.29
  Bottom 0.406: A/V.2 6.67,55.88 23.18,55.88 24.77,54.29 29.77,54.29 R7.1 | v31.12,74.61 36.84,74.61 38.74,76.52 38.74,79.06 39.6,79.92 VIDEO.8
RED0
  Bottom 0.406: R1.1 41.28,28.89 IC1.22
RED1
  Bottom 0.406: R5.1 40.64,31.43 41.91,32.7 IC1.23
RED2
  Bottom 0.406: R6.1 40.64,33.97 41.91,35.24 IC1.24
RESET  (via drill 0.3)
  Top 0.406: v20.32,23.18 22.86,25.72 22.86,26.99 26.04,30.16 v26.04,33.34 26.04,42.86 | 26.04,42.86 26.04,55.56 | 26.04,55.56 26.04,65.72 25.41,66.36 25.41,67.63 ISP.5 C8.1 | IC1.9 26.04,55.56 | R12.1 26.04,42.86
  Bottom 0.406: U$1.1B 20.17,23.02 v20.32,23.18 20.96,23.81 26.04,23.81 v26.68,23.18 26.83,23.02 U$1.4B | EXT.8 5.72,34.61 6.99,33.34 v26.04,33.34
SCK  (via drill 0.3)
  Top 0.406: v21.28,30.16 21.28,57.15 IC3.6 | ISP.3 25.41,65.09 25.41,58.74 v24.77,58.1
  Bottom 0.406: R27.2 29.21,59.37 27.95,58.1 IC1.8 v24.77,58.1 20.96,58.1 19.05,60.01 IC3.6 | v21.28,30.16 8.89,30.16 8.26,30.8 6.36,30.8 EXT.6
SCK_3V3  (via drill 0.3)
  Top 0.406: R30.2 R27.1 | v36.84,59.37 v36.84,78.74
  Bottom 0.406: R27.1 v36.84,59.37 | v36.84,78.74 36.52,79.06 24.45,79.06 21.59,81.92 13.34,81.92 11.19,79.76 J1.5
SD_CE  (via drill 0.3)
  Top 0.406: v35.88,27.62 v35.88,63.18
  Bottom 0.406: IC1.20 v35.88,27.62 | v35.88,63.18 31.12,63.18 R26.2
SD_CE_3V3  (via drill 0.3)
  Top 0.406: R29.2 R26.1 | v35.88,64.45 v35.88,75.88
  Bottom 0.406: R26.1 v35.88,64.45 | J1.2 14.49,79.25 15.24,80.01 20.96,80.01 23.5,77.47 27.63,77.47 29.21,75.88 v35.88,75.88
SNES_CLK  (via drill 0.3)
  Top 0.406: v38.74,26.03 v38.74,68.26
  Bottom 0.406: v38.74,68.26 IC1.37 | CTRL1.5 16.38,23.05 21.28,27.94 25.09,27.94 26.99,26.03 v38.74,26.03 39.6,25.18 CTRL2.5
SNES_DATA1  (via drill 0.3)
  Top 0.406: v41.28,21.91 41.28,75.25 41.91,75.88 IC1.40
  Bottom 0.406: 34.93,21.91 29.53,21.91 26.99,24.45 20.32,24.45 14.93,19.05 12.71,19.05 12.07,19.69 12.07,20.58 CTRL1.1 | 34.93,21.91 v41.28,21.91 | CTRL2.2 34.9,21.88 34.93,21.91
SNES_DATA2  (via drill 0.3)
  Top 0.406: v37.79,73.34 v37.79,25.08 37.5,24.79 CTRL2.1
  Bottom 0.406: v37.79,73.34 IC1.39 | v37.79,25.08 26.68,25.08 24.77,26.99 21.59,26.99 16.52,21.91 11,21.91 9.64,20.55 CTRL1.2
SNES_LATCH  (via drill 0.3)
  Top 0.406: v33.98,70.8 v33.98,30.16 33.98,24.22 CTRL2.6
  Bottom 0.406: v33.98,70.8 IC1.38 | v33.98,30.16 29.21,30.16 27.95,28.89 20.96,28.89 16.52,24.45 8.89,24.45 7.5,23.05 CTRL1.6
SPIRAM_EN
  Top 0.406: IC3.1 10.8,64.45 9.53,63.18 9.53,55.56 9.85,55.25 9.85,30.16 9.21,29.53 EXT.3
  Bottom 0.406: IC1.36 29.21,65.72 27.95,66.99 26.04,66.99 25.41,67.63 20.96,67.63 20.32,66.99 12.71,66.99 IC3.1
UART0_RX  (via drill 0.3)
  Top 0.406: ESP.TXD0 14.06,89.94 11.44,87.31 11.44,71.76 12.39,70.8 13.34,70.8 14.29,69.85 14.29,56.83 14.93,56.2 v14.93,39.69 v14.93,35.88
  Bottom 0.406: IC1.14 25.72,41.27 19.69,41.27 18.1,39.69 v14.93,39.69 | v14.93,35.88 6.99,35.88 5.72,37.15 EXT.10
UART0_TX  (via drill 0.3)
  Top 0.406: v22.23,37.78 v22.23,40.32 22.23,57.47 19.69,60.01 19.69,67.94 16.83,70.8 14.93,70.8 13.97,71.76 13.97,84.14 15.24,85.41 17.15,85.41 19.68,87.94 ESP.RXD0
  Bottom 0.406: v22.23,40.32 IC1.15 | EXT.12 6.36,38.42 8.89,38.42 9.53,37.78 v22.23,37.78
UART1_RX  (via drill 0.3)
  Top 0.406: v22.86,32.07 22.86,36.83 v24.14,38.1
  Bottom 0.406: IC1.16 26.99,38.1 v24.14,38.1 | SV1.4 8.3,70.48 5.4,70.48 2.55,67.63 2.55,33.97 3.18,33.34 5.72,33.34 6.99,32.07 EXT.5 v22.86,32.07
UART1_TX
  Bottom 0.406: IC1.17 26.68,34.61 EXT.7 6.99,34.61 5.72,35.88 3.82,35.88 3.18,36.51 3.18,66.99 5.72,69.53 9.85,69.53 12.66,72.35 SV1.3
VIDEO_CE/VSYNC  (via drill 0.3)
  Top 0.406: v29.85,81.6 26.04,77.79 26.04,66.99 IC1.5
  Bottom 0.305: SJ2.1 42.55,82.63 42.11,83.07
  Bottom 0.406: v29.85,81.6 35.56,81.6 36.2,82.23 36.2,83.5 36.84,84.14 41.04,84.14 42.11,83.07 42.14,83.04
VIDEO_CLK/HSYNC
  Bottom 0.406: IC1.4 25.41,70.17 20.96,70.17 18.42,67.63 8.26,67.63 6.36,65.72 6.36,63.82 A/V.5
VIDEO_SYNC  (via drill 0.3)
  Top 0.406: A/V.3 6.36,61.28 4.13,61.28 3.5,61.91 v3.5,74.29 | IC1.1 27.31,77.79 32.37,82.85 VIDEO.3
  Bottom 0.406: v3.5,74.29 3.5,81.28 5.09,82.87 21.91,82.87 22.55,82.23 26.68,82.23 27.31,82.87 32.78,82.87 VIDEO.3

### Text on the board
tPlace: Bluescreens Uzebox | http://uzebox.org | 1 | 1
bPlace: Video | A/V | EXT